# Altium schematic sheet Schematic.SchDoc (part 2 of 2)
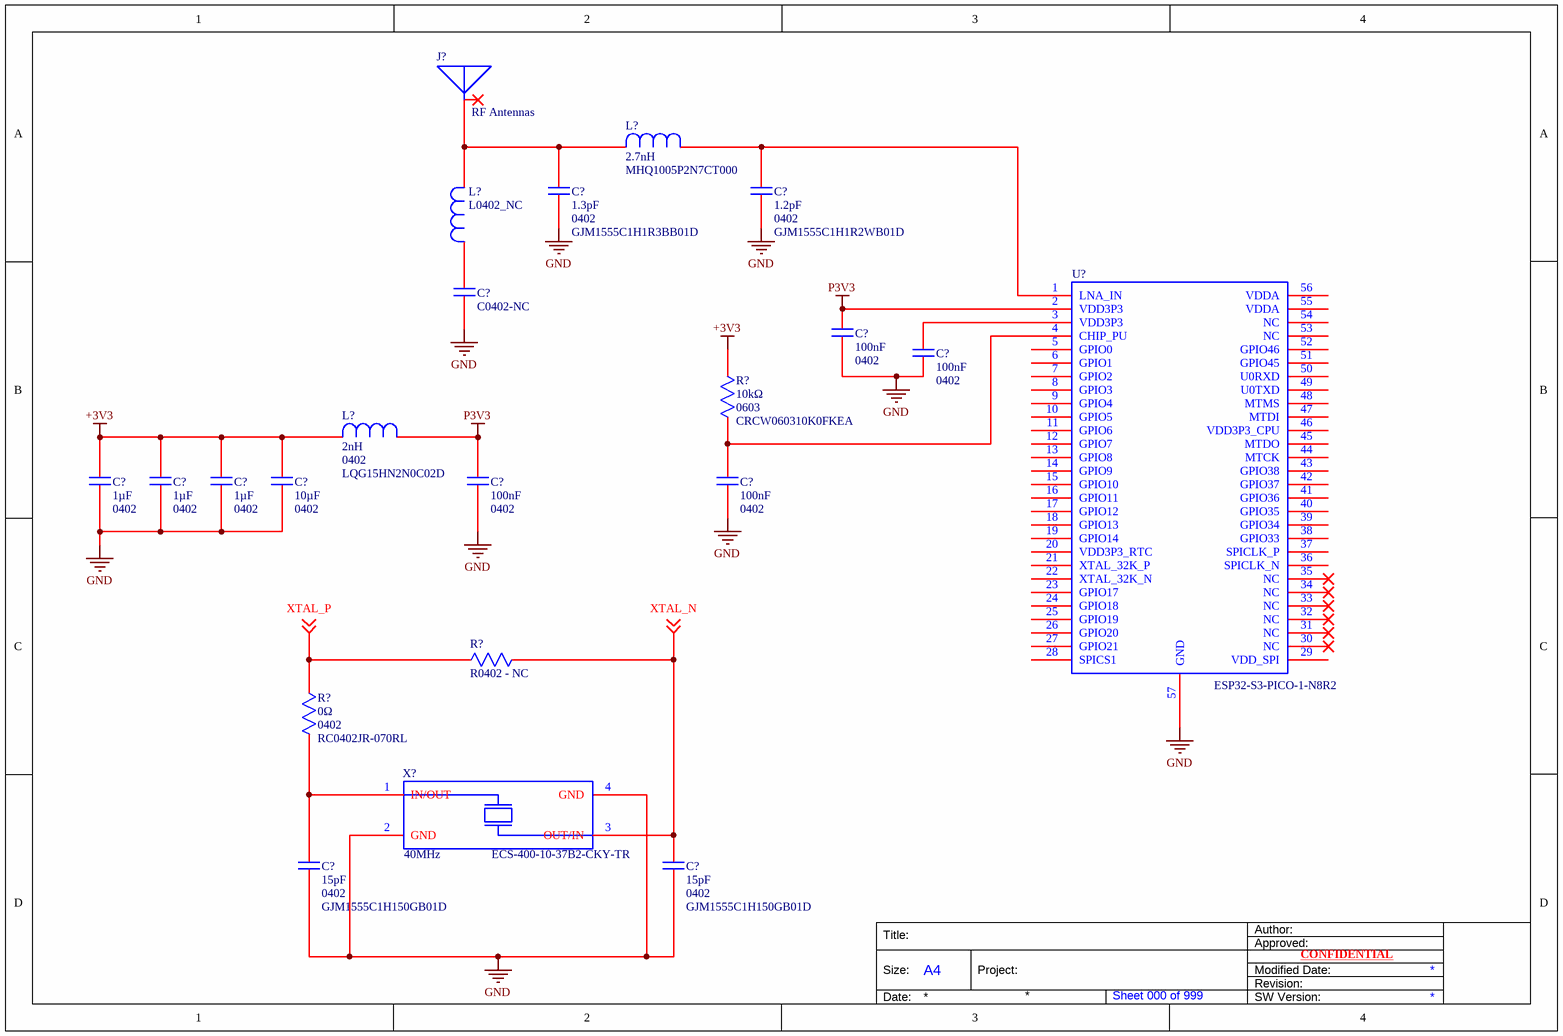
[diagram p1: Schematic.SchDoc]

## Library data of the parts (continued)
R?#1 = CRCW060310K0FKEA: Fixed Resistor, Metal Glaze/Thick Film, 0.1W, 10000ohm, 75V, 1% +/-Tol, Surface Mount, 0603; Manufacturer: Vishay; Max Power Dissipation: 100mW; Temperature Coefficient: 100ppm/°C; Supplier: DigiKey; Supplier Part Number: 541-10.0KHCT-ND; Manufacturer Part Number: CRCW060310K0FKEA; RoHS: Compliant; Category: Chip SMD Resistors; Stock: 5381974; Pricing: 1=0,1, 10=0,032, 25=0,024, 50=0,0194, 100=0,0158, 250=0,0124, 500=0,01046, 1000=0,00893 (USD); Case/Package: 0603; China RoHS: Non-Compliant; Composition: Thick Film; Contact Plating: Lead, Tin; Country of Origin: Israel, Taiwan; Depth: 850µm; Export Control Classification Number (ECCN) Code: EAR99; Features: Automotive AEC-Q200; Height: 450µm; Harmonized Tariff Schedule (HTS) Code: 8533.21.00.30; Introduction Date: 2005-02-16; Lead Free: Lead Free; Length: 1.55mm; Lifecycle Status: Production; Max Operating Temperature: 155°C; Military Standard: Not; Min Operating Temperature: -55°C; Mounting Technology: Surface Mount; Pins: 2; Number of Terminals: 2; Number of Terminations: 2; Packaging: Tape and Reel; Power Rating: 100mW; Radiation Hardening: No; Ratings: AEC-Q200; REACH SVHC: Yes; Schedule B: 8533210045, 8533210045|8533210045|8533210045|8533210045|8533210045|8533210045|8533210045|8533210045|8533210045|8533210045|8533210045|8533210045|8533210045|8533210045|8533210045|8533210045|8533210045|8533210045|8533210045|8533210045|8533210045|8533210045|8533210045|85; Termination: SMD/SMT; Tolerance: 1%; Voltage Rating: 75V; Voltage Rating (DC): 75V; Weight: 2.012816mg; Width: 850µm; Working Voltage: 75V; ComponentLink1URL: https://datasheet.octopart.com:443/CRCW060310K0FKEA-Vishay-datasheet-175423584.pdf?src-supplier=IHS; ComponentLink1Description: https://datasheet.octopart.com:443/CRCW060310K0FKEA-Vishay-datasheet-175423584.pdf?src-supplier=IHS; ComponentLink2URL: https://datasheet.octopart.com:443/CRCW060310K0FKEA-Vishay-datasheet-5300368.pdf?src-supplier=Future+Electronics; ComponentLink2Description: https://datasheet.octopart.com:443/CRCW060310K0FKEA-Vishay-datasheet-5300368.pdf?src-supplier=Future+Electronics; ComponentLink3URL: https://datasheet.octopart.com:443/CRCW060310K0FKEA-Vishay-datasheet-62316122.pdf?src-supplier=Future+Electronics; ComponentLink3Description: https://datasheet.octopart.com:443/CRCW060310K0FKEA-Vishay-datasheet-62316122.pdf?src-supplier=Future+Electronics; ComponentLink4URL: https://datasheet.octopart.com:443/CRCW060310K0FKEA-Vishay-datasheet-141434677.pdf?src-supplier=Upverter; ComponentLink4Description: https://datasheet.octopart.com:443/CRCW060310K0FKEA-Vishay-datasheet-141434677.pdf?src-supplier=Upverter; ComponentLink5URL: https://datasheet.octopart.com:443/CRCW060310K0FKEA-Vishay-datasheet-83961561.pdf?src-supplier=Newark; ComponentLink5Description: https://datasheet.octopart.com:443/CRCW060310K0FKEA-Vishay-datasheet-83961561.pdf?src-supplier=Newark; ComponentLink6URL: https://datasheet.octopart.com:443/CRCW060310K0FKEA-Vishay-datasheet-14722531.pdf?src-supplier=Newark; ComponentLink6Description: https://datasheet.octopart.com:443/CRCW060310K0FKEA-Vishay-datasheet-14722531.pdf?src-supplier=Newark; ComponentLink7URL: https://datasheet.octopart.com:443/CRCW060310K0FKEA-Vishay-datasheet-11516975.pdf?src-supplier=Newark; ComponentLink7Description: https://datasheet.octopart.com:443/CRCW060310K0FKEA-Vishay-datasheet-11516975.pdf?src-supplier=Newark; ComponentLink8URL: https://datasheet.octopart.com:443/CRCW060310K0FKEA-Vishay-datasheet-41302739.pdf?src-supplier=Newark; ComponentLink8Description: https://datasheet.octopart.com:443/CRCW060310K0FKEA-Vishay-datasheet-41302739.pdf?src-supplier=Newark; ComponentLink9URL: https://datasheet.octopart.com:443/CRCW060310K0FKEA-Vishay-datasheet-33013972.pdf?src-supplier=Newark; ComponentLink9Description: https://datasheet.octopart.com:443/CRCW060310K0FKEA-Vishay-datasheet-33013972.pdf?src-supplier=Newark; ComponentLink10URL: https://datasheet.octopart.com:443/CRCW060310K0FKEA-Vishay-datasheet-21226360.pdf?src-supplier=Newark; ComponentLink10Description: https://datasheet.octopart.com:443/CRCW060310K0FKEA-Vishay-datasheet-21226360.pdf?src-supplier=Newark; ComponentLink11URL: https://datasheet.octopart.com:443/CRCW060310K0FKEA-Vishay-datasheet-62317933.pdf?src-supplier=element14+APAC; ComponentLink11Description: https://datasheet.octopart.com:443/CRCW060310K0FKEA-Vishay-datasheet-62317933.pdf?src-supplier=element14+APAC; ComponentLink12URL: https://datasheet.octopart.com:443/CRCW060310K0FKEA-Vishay-datasheet-16179825.pdf?src-supplier=element14+APAC; ComponentLink12Description: https://datasheet.octopart.com:443/CRCW060310K0FKEA-Vishay-datasheet-16179825.pdf?src-supplier=element14+APAC; ComponentLink13URL: https://datasheet.octopart.com:443/CRCW060310K0FKEA-Vishay-datasheet-66077789.pdf?src-supplier=element14+APAC; ComponentLink13Description: https://datasheet.octopart.com:443/CRCW060310K0FKEA-Vishay-datasheet-66077789.pdf?src-supplier=element14+APAC; ComponentLink14URL: https://datasheet.octopart.com:443/CRCW060310K0FKEA-Vishay-datasheet-5306405.pdf?src-supplier=RS+(Formerly+Allied+Electronics); ComponentLink14Description: https://datasheet.octopart.com:443/CRCW060310K0FKEA-Vishay-datasheet-5306405.pdf?src-supplier=RS+(Formerly+Allied+Electronics); ComponentLink15URL: https://datasheet.octopart.com:443/CRCW060310K0FKEA-Vishay-Dale-datasheet-47688880.pdf?src-supplier=RS+(Formerly+Allied+Electronics); ComponentLink15Description: https://datasheet.octopart.com:443/CRCW060310K0FKEA-Vishay-Dale-datasheet-47688880.pdf?src-supplier=RS+(Formerly+Allied+Electronics); ComponentLink16URL: https://datasheet.octopart.com:443/CRCW060310K0FKEA-Vishay-datasheet-12001583.pdf?src-supplier=RS+(Formerly+Allied+Electronics); ComponentLink16Description: https://datasheet.octopart.com:443/CRCW060310K0FKEA-Vishay-datasheet-12001583.pdf?src-supplier=RS+(Formerly+Allied+Electronics); ComponentLink17URL: https://datasheet.octopart.com:443/CRCW060310K0FKEA-Vishay-datasheet-17834126.pdf?src-supplier=TME; ComponentLink17Description: https://datasheet.octopart.com:443/CRCW060310K0FKEA-Vishay-datasheet-17834126.pdf?src-supplier=TME; ComponentLink18URL: https://datasheet.octopart.com/D-CRCW-e3-Standard-Thick-Film-Chip-Resistors-Vishay-datasheet-family-64.pdf; ComponentLink18Description: https://datasheet.octopart.com/D-CRCW-e3-Standard-Thick-Film-Chip-Resistors-Vishay-datasheet-family-64.pdf; ComponentLink19URL: https://datasheet.octopart.com:443/CRCW060310K0FKEA-Vishay-datasheet-13242068.pdf?src-supplier=Farnell; ComponentLink19Description: https://datasheet.octopart.com:443/CRCW060310K0FKEA-Vishay-datasheet-13242068.pdf?src-supplier=Farnell; ComponentLink20URL: https://datasheet.octopart.com:443/CRCW060310K0FKEA-Vishay-datasheet-13195083.pdf?src-supplier=Farnell; ComponentLink20Description: https://datasheet.octopart.com:443/CRCW060310K0FKEA-Vishay-datasheet-13195083.pdf?src-supplier=Farnell; ComponentLink21URL: https://datasheet.octopart.com:443/CRCW060310K0FKEA-Vishay-datasheet-13034211.pdf?src-supplier=Farnell; ComponentLink21Description: https://datasheet.octopart.com:443/CRCW060310K0FKEA-Vishay-datasheet-13034211.pdf?src-supplier=Farnell; ComponentLink22URL: https://datasheet.octopart.com:443/CRCW060310K0FKEA-Vishay-datasheet-12600034.pdf?src-supplier=Farnell; ComponentLink22Description: https://datasheet.octopart.com:443/CRCW060310K0FKEA-Vishay-datasheet-12600034.pdf?src-supplier=Farnell; ComponentLink23URL: https://datasheet.octopart.com:443/CRCW060310K0FKEA-Vishay-datasheet-12532161.pdf?src-supplier=Farnell; ComponentLink23Description: https://datasheet.octopart.com:443/CRCW060310K0FKEA-Vishay-datasheet-12532161.pdf?src-supplier=Farnell; ComponentLink24URL: https://datasheet.octopart.com:443/CRCW060310K0FKEA-Vishay-datasheet-12517896.pdf?src-supplier=Farnell; ComponentLink24Description: https://datasheet.octopart.com:443/CRCW060310K0FKEA-Vishay-datasheet-12517896.pdf?src-supplier=Farnell; ComponentLink25URL: https://datasheet.octopart.com:443/CRCW060310K0FKEA-Vishay-datasheet-12509762.pdf?src-supplier=Farnell; ComponentLink25Description: https://datasheet.octopart.com:443/CRCW060310K0FKEA-Vishay-datasheet-12509762.pdf?src-supplier=Farnell; ComponentLink26URL: https://datasheet.octopart.com:443/CRCW060310K0FKEA-Vishay-datasheet-10322335.pdf?src-supplier=Farnell; ComponentLink26Description: https://datasheet.octopart.com:443/CRCW060310K0FKEA-Vishay-datasheet-10322335.pdf?src-supplier=Farnell; ComponentLink27URL: https://datasheet.octopart.com:443/CRCW060310K0FKEA-Vishay-datasheet-8788789.pdf?src-supplier=Farnell; ComponentLink27Description: https://datasheet.octopart.com:443/CRCW060310K0FKEA-Vishay-datasheet-8788789.pdf?src-supplier=Farnell; ComponentLink28URL: https://datasheet.octopart.com:443/CRCW060310K0FKEA-Vishay-datasheet-8361388.pdf?src-supplier=Farnell; ComponentLink28Description: https://datasheet.octopart.com:443/CRCW060310K0FKEA-Vishay-datasheet-8361388.pdf?src-supplier=Farnell; ComponentLink29URL: https://datasheet.octopart.com:443/CRCW060310K0FKEA-Vishay-datasheet-546287.pdf?src-supplier=Farnell; ComponentLink29Description: https://datasheet.octopart.com:443/CRCW060310K0FKEA-Vishay-datasheet-546287.pdf?src-supplier=Farnell; ComponentLink30URL: https://datasheet.octopart.com:443/CRCW060310K0FKEA-Vishay-datasheet-8619608.pdf?src-supplier=element14; ComponentLink30Description: https://datasheet.octopart.com:443/CRCW060310K0FKEA-Vishay-datasheet-8619608.pdf?src-supplier=element14; ComponentLink31URL: https://datasheet.octopart.com:443/CRCW060310K0FKEA-Vishay-datasheet-5377433.pdf?src-supplier=Garrett; ComponentLink31Description: https://datasheet.octopart.com:443/CRCW060310K0FKEA-Vishay-datasheet-5377433.pdf?src-supplier=Garrett; ComponentLink32URL: https://datasheet.octopart.com:443/CRCW060310K0FKEA-Vishay-datasheet-148188.pdf?src-supplier=Garrett; ComponentLink32Description: https://datasheet.octopart.com:443/CRCW060310K0FKEA-Vishay-datasheet-148188.pdf?src-supplier=Garrett; ComponentLink33URL: https://datasheet.octopart.com:443/CRCW060310K0FKEA-Vishay-datasheet-30224.pdf?src-supplier=Garrett; ComponentLink33Description: https://datasheet.octopart.com:443/CRCW060310K0FKEA-Vishay-datasheet-30224.pdf?src-supplier=Garrett; ComponentLink34URL: https://datasheet.octopart.com:443/CRCW060310K0FKEA-Vishay-datasheet-11835177.pdf?src-supplier=Arrow+Electronics; ComponentLink34Description: https://datasheet.octopart.com:443/CRCW060310K0FKEA-Vishay-datasheet-11835177.pdf?src-supplier=Arrow+Electronics; ComponentLink35URL: http://sigma.octopart.com:80/rohs_certificate/D-CRCW-e3-Standard-Thick-Film-Chip-Resistors-Vishay-family-102.pdf?src-supplier=Compliance+Statements; ComponentLink35Description: http://sigma.octopart.com:80/rohs_certificate/D-CRCW-e3-Standard-Thick-Film-Chip-Resistors-Vishay-family-102.pdf?src-supplier=Compliance+Statements; LCSC Part: C844918
R?#2 = R 0402 - NC
R?#3 = RC0402JR-070RL: GENERAL PURPOSE CHIP RESISTOR Metal Glaze/thick Film, 0.0625W, 0ohm, Surface Mount, 0402; Manufacturer: Yageo Group; Max Power Dissipation: 63mW; Power Rating: 62.5mW; Temperature Coefficient: 200ppm/°C; Tolerance: 5%; Voltage Rating: 50V; Supplier: DigiKey; Supplier Part Number: 311-0.0JRDKR-ND; Manufacturer Part Number: RC0402JR-070RL; RoHS: Compliant; Category: Chip SMD Resistors; Stock: 12719023; Pricing: 1=0,1, 10=0,010, 25=0,0064, 50=0,0056, 100=0,0048, 250=0,00404, 500=0,00356, 1000=0,00313, 5000=0,00237 (USD); Case Code (Imperial): 0402; China RoHS: Non-Compliant; Composition: Thick Film; Contact Plating: Tin; Depth: 500µm; Features: Moisture Resistant; Height: 350µm; Lead Free: Lead Free; Length: 1mm; Lifecycle Status: Production; Max Operating Temperature: 155°C; Military Standard: Not; Min Operating Temperature: -55°C; Mounting Technology: Surface Mount; Pins: 2; Number of Terminals: 2; Number of Terminations: 2; Packaging: Tape & Reel; Radiation Hardening: No; REACH SVHC: Yes; Schedule B: 8533290000, 8533290000|8533290000, 8533290000|8533290000|8533290000, 8533290000|8533290000|8533290000|8533290000; Termination: SMD/SMT; Voltage Rating (DC): 50V; Width: 500µm; ComponentLink1URL: https://datasheet.octopart.com:443/RC0402JR-070RL-Yageo-datasheet-182189538.pdf?src-supplier=IHS; ComponentLink1Description: https://datasheet.octopart.com:443/RC0402JR-070RL-Yageo-datasheet-182189538.pdf?src-supplier=IHS; ComponentLink2URL: https://datasheet.octopart.com:443/RC0402JR-070RL-Yageo-datasheet-10408619.pdf?src-supplier=Newark; ComponentLink2Description: https://datasheet.octopart.com:443/RC0402JR-070RL-Yageo-datasheet-10408619.pdf?src-supplier=Newark; ComponentLink3URL: https://datasheet.octopart.com:443/RC0402JR-070RL-Yageo-Group-datasheet-181964826.pdf?src-supplier=Newark; ComponentLink3Description: https://datasheet.octopart.com:443/RC0402JR-070RL-Yageo-Group-datasheet-181964826.pdf?src-supplier=Newark; ComponentLink4URL: https://datasheet.octopart.com:443/RC0402JR-070RL-Yageo-Group-datasheet-190305687.pdf?src-supplier=Future+Electronics; ComponentLink4Description: https://datasheet.octopart.com:443/RC0402JR-070RL-Yageo-Group-datasheet-190305687.pdf?src-supplier=Future+Electronics; ComponentLink5URL: https://datasheet.octopart.com:443/RC0402JR-070RL-Yageo-datasheet-164759695.pdf?src-supplier=Future+Electronics; ComponentLink5Description: https://datasheet.octopart.com:443/RC0402JR-070RL-Yageo-datasheet-164759695.pdf?src-supplier=Future+Electronics; ComponentLink6URL: https://datasheet.octopart.com:443/RC0402JR-070RL-Yageo-datasheet-137700087.pdf?src-supplier=Future+Electronics; ComponentLink6Description: https://datasheet.octopart.com:443/RC0402JR-070RL-Yageo-datasheet-137700087.pdf?src-supplier=Future+Electronics; ComponentLink7URL: https://datasheet.octopart.com:443/RC0402JR-070RL-Yageo-datasheet-12531192.pdf?src-supplier=Seeed+Studio; ComponentLink7Description: https://datasheet.octopart.com:443/RC0402JR-070RL-Yageo-datasheet-12531192.pdf?src-supplier=Seeed+Studio; ComponentLink8URL: https://datasheet.octopart.com:443/RC0402JR-070RL-Yageo-datasheet-8324527.pdf?src-supplier=TME; ComponentLink8Description: https://datasheet.octopart.com:443/RC0402JR-070RL-Yageo-datasheet-8324527.pdf?src-supplier=TME; ComponentLink9URL: https://datasheet.octopart.com:443/RC0402JR-070RL-Yageo-datasheet-62067350.pdf?src-supplier=Farnell; ComponentLink9Description: https://datasheet.octopart.com:443/RC0402JR-070RL-Yageo-datasheet-62067350.pdf?src-supplier=Farnell; ComponentLink10URL: https://datasheet.octopart.com:443/RC0402JR-070RL-Yageo-datasheet-8329306.pdf?src-supplier=element14; ComponentLink10Description: https://datasheet.octopart.com:443/RC0402JR-070RL-Yageo-datasheet-8329306.pdf?src-supplier=element14; ComponentLink11URL: https://datasheet.octopart.com:443/RC0402JR-070RL-Yageo-datasheet-505231.pdf?src-supplier=element14; ComponentLink11Description: https://datasheet.octopart.com:443/RC0402JR-070RL-Yageo-datasheet-505231.pdf?src-supplier=element14; ComponentLink12URL: https://datasheet.octopart.com:443/RC0402JR-070RL-Yageo-datasheet-175423674.pdf?src-supplier=SOS+electronic; ComponentLink12Description: https://datasheet.octopart.com:443/RC0402JR-070RL-Yageo-datasheet-175423674.pdf?src-supplier=SOS+electronic; ComponentLink13URL: https://datasheet.octopart.com/RC0402JR-070RL-Yageo-datasheet-73766026.pdf; ComponentLink13Description: https://datasheet.octopart.com/RC0402JR-070RL-Yageo-datasheet-73766026.pdf; ComponentLink14URL: http://sigma.octopart.com:80/conflict_mineral_statement/Yageo-company-3.pdf?src-supplier=Compliance+Statements; ComponentLink14Description: http://sigma.octopart.com:80/conflict_mineral_statement/Yageo-company-3.pdf?src-supplier=Compliance+Statements; ComponentLink15URL: http://sigma.octopart.com:80/rohs_statement/Yageo-company-2.pdf?src-supplier=Compliance+Statements; ComponentLink15Description: http://sigma.octopart.com:80/rohs_statement/Yageo-company-2.pdf?src-supplier=Compliance+Statements; LCSC Part: C60485
U? = ESP32-S3-PICO-1-N8R2: ESP32-S3-PICO-1 Is A System-in-p; Manufacturer: Espressif Systems; Supplier: DigiKey; Supplier Part Number: 1965-ESP32-S3-PICO-1-N8R2DKR-ND; Manufacturer Part Number: ESP32-S3-PICO-1-N8R2; Category: RF Transceiver Modules and Modems; Stock: 1099; Pricing: 1=6,1, 10=5,281, 25=4,9968, 100=4,6063, 250=4,37224, 500=4,20692, 1000=4,05122 (USD); LCSC Part: *
X? = ECS-400-10-37B2-CKY-TR: Crystal 40MHz ±10ppm (Tol) ±10ppm (Stability) 10pF FUND 40Ohm 4-Pin Mini-CSMD T/R; Manufacturer: ECS International; Frequency Tolerance: 0.001%; ESR: 40Ω; Supplier: DigiKey; Supplier Part Number: 50-ECS-400-10-37B2-CKY-TRDKR-ND; Manufacturer Part Number: ECS-400-10-37B2-CKY-TR; RoHS: Compliant; Category: Crystals; Stock: 15648; Pricing: 1=0,36, 10=0,312, 25=0,2952, 50=0,2832, 100=0,2714, 250=0,25668, 500=0,24608, 1000=0,23589 (USD); Export Control Classification Number (ECCN) Code: EAR99; Frequency Stability: 10ppm; Harmonized Tariff Schedule (HTS) Code: 8541.60.00.60; Introduction Date: 2021-06-03; Lifecycle Status: Production; Load Capacitance: 10pF; Max Operating Temperature: 85°C; Min Operating Temperature: -30°C; Mounting Technology: Surface Mount; REACH SVHC: Yes; ComponentLink1URL: https://datasheet.octopart.com:443/ECS-400-10-37B2-CKY-TR-ECS-International-datasheet-163707945.pdf?src-supplier=Future+Electronics; ComponentLink1Description: https://datasheet.octopart.com:443/ECS-400-10-37B2-CKY-TR-ECS-International-datasheet-163707945.pdf?src-supplier=Future+Electronics; LCSC Part: C5357833